# EAGLE design circularpiholder (EAGLE 7.6.0)
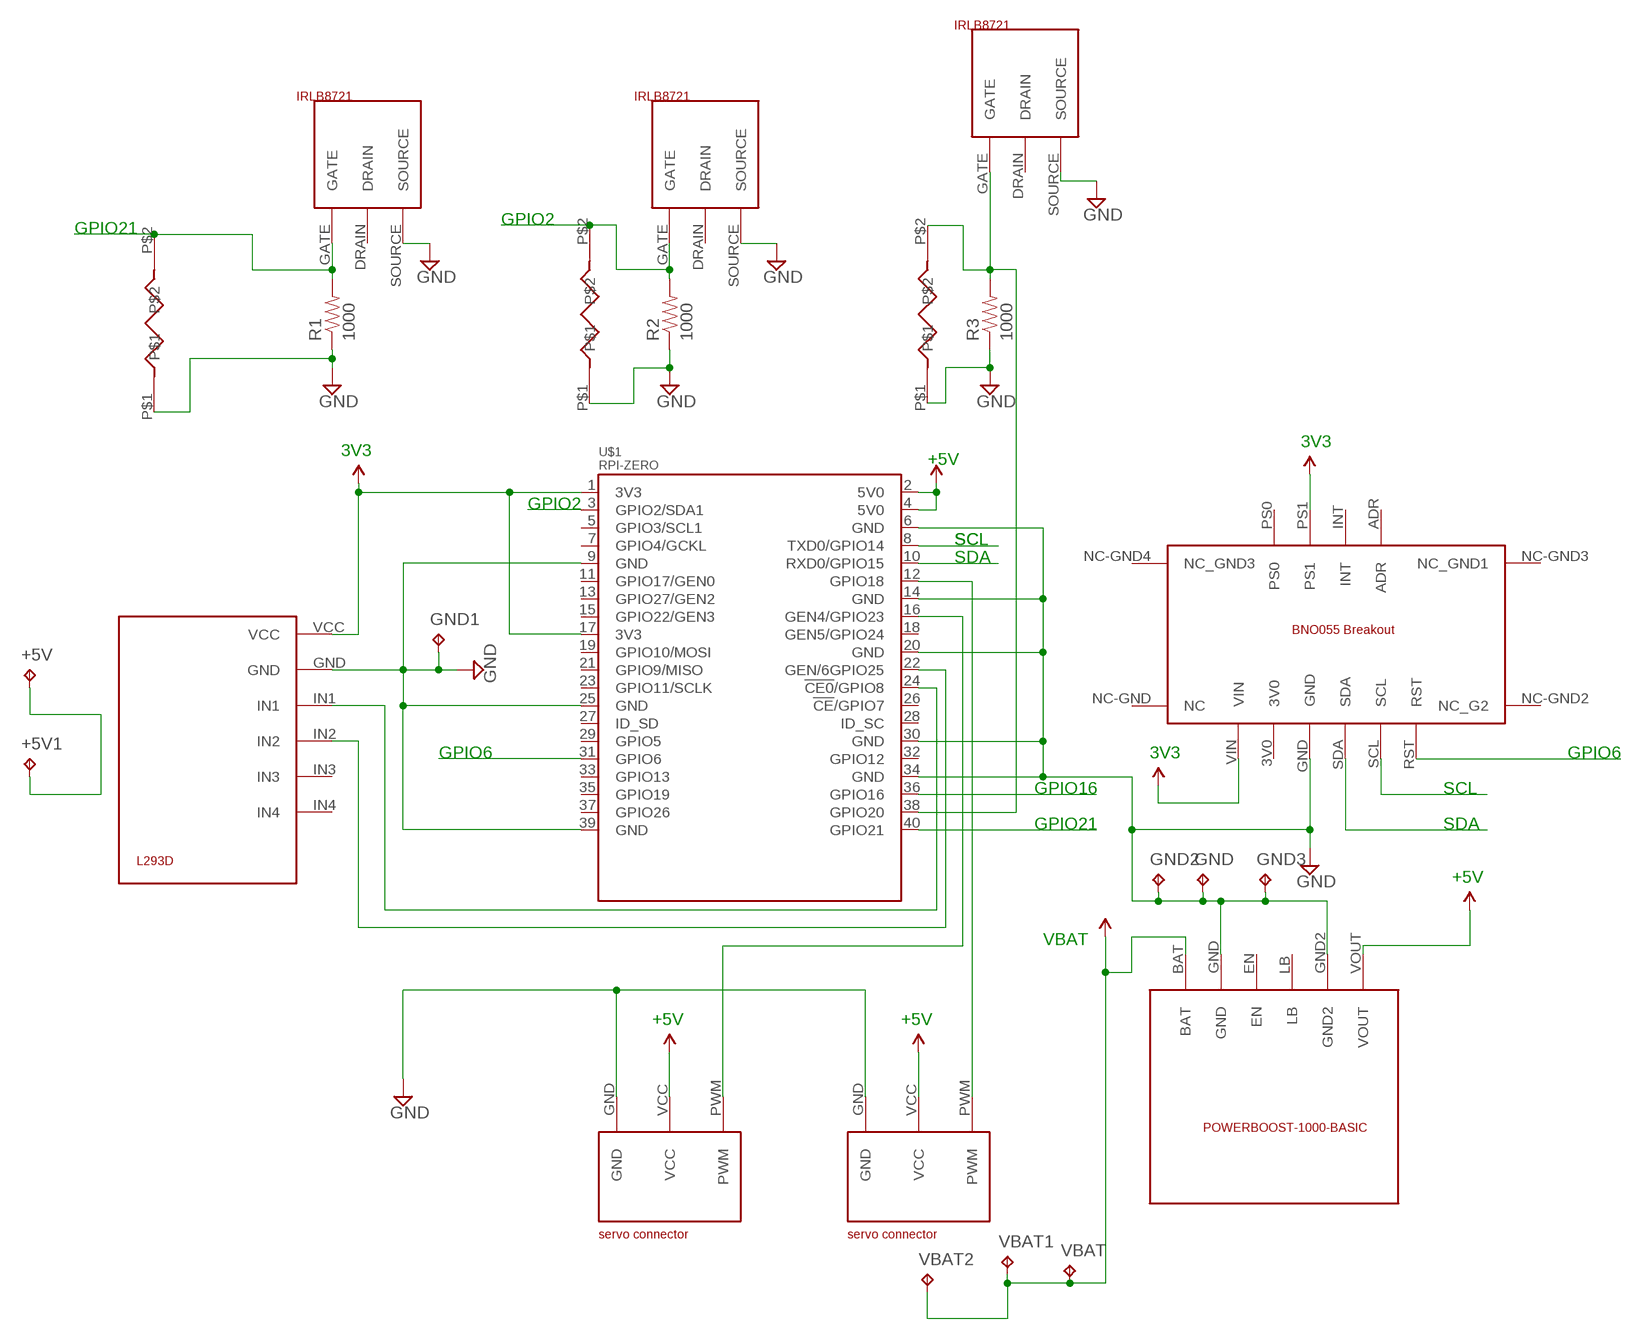
[diagram p0: schematic, sheet 1]

## Parts
+5V  TPTP20SQ  [TP20SQ]
+5V1  TPTP20SQ  [TP20SQ]
GND  TPTP20SQ  [TP20SQ]
GND1  TPTP20SQ  [TP20SQ]
GND2  TPTP20SQ  [TP20SQ]
GND3  TPTP20SQ  [TP20SQ]
R1  1000  RESISTOR0603-RES  [0603-RES]
R2  1000  RESISTOR0603-RES  [0603-RES]
R3  1000  RESISTOR0603-RES  [0603-RES]
U$1  RPI-ZERO  [RASPBERRYPI_BASTELSTUBE_V13_RASPI_BOARD_B+_FULL]
U$2  BNO055-BREAKOUT  [BNO055BREAKOUT]
U$3  POWERBOOST1000-BASIC  [POWERBOOST1000-BASIC]
U$4  MOSFET-IRLB872  [MOSFET-IRLB8721]
U$5  MOSFET-IRLB872  [MOSFET-IRLB8721]
U$6  MOSFET-IRLB872  [MOSFET-IRLB8721]
U$7  L293D-DUALMOTORCONTROL  [L293D-DUALMOTORCONTROL]
U$8  SERVO-3PIN-CONN  [SERVO-3PIN-CONN]
U$9  SERVO-3PIN-CONN  [SERVO-3PIN-CONN]
U$10  SURFACEMNT-RESSURFACEMNT  [SURFACEMNT-RES]
U$11  SURFACEMNT-RESSURFACEMNT  [SURFACEMNT-RES]
U$12  SURFACEMNT-RESSURFACEMNT  [SURFACEMNT-RES]
VBAT  TPTP20SQ  [TP20SQ]
VBAT1  TPTP20SQ  [TP20SQ]
VBAT2  TPTP20SQ  [TP20SQ]

## Nets
3V3: U$1.1(3V3) U$1.17(3V3) U$2.PS1 U$2.VIN U$7.VCC ; supply symbol labelled 5V
+5V: +5V1.TP +5V.TP U$1.2(5V0) U$1.4(5V0) U$3.VOUT U$8.VCC U$9.VCC ; supply symbol labelled 5V
GPIO2: R2.2 U$1.3(GPIO2/SDA1) U$5.GATE U$11.P$2
GPIO6: U$1.31(GPIO6) U$2.RST
GPIO16: U$1.36(GPIO16)
GPIO21: R1.2 U$1.40(GPIO21) U$6.GATE U$10.P$2
GROUND: GND1.TP GND2.TP GND3.TP GND.TP R1.1 R2.1 R3.1 U$1.6(GND) U$1.9(GND) U$1.14(GND) U$1.20(GND) U$1.25(GND) U$1.30(GND) U$1.34(GND) U$1.39(GND) U$2.GND U$3.GND U$3.GND2 U$4.SOURCE U$5.SOURCE U$6.SOURCE U$7.GND U$8.GND U$9.GND U$10.P$1 U$11.P$1 U$12.P$1 ; supply symbol labelled GND
N$1: R3.2 U$1.38(GPIO20) U$4.GATE U$12.P$2
N$3: U$1.12(GPIO18) U$9.PWM
N$4: U$1.16(GEN4/GPIO23) U$8.PWM
N$5: U$1.24(!CE0!/GPIO8) U$7.IN1
N$7: U$1.22(GEN/6GPIO25) U$7.IN2
SCL: U$1.8(TXD0/GPIO14) U$2.SCL
SDA: U$1.10(RXD0/GPIO15) U$2.SDA
VBAT: U$3.BAT VBAT1.TP VBAT2.TP VBAT.TP ; supply symbol labelled 5V
Unconnected: U$1.5(GPIO3/SCL1) U$1.7(GPIO4/GCKL) U$1.11(GPIO17/GEN0) U$1.13(GPIO27/GEN2) U$1.15(GPIO22/GEN3) U$1.18(GEN5/GPIO24) U$1.19(GPIO10/MOSI) U$1.21(GPIO9/MISO) U$1.23(GPIO11/SCLK) U$1.26(!CE!/GPIO7) U$1.27(ID_SD) U$1.28(ID_SC) U$1.29(GPIO5) U$1.32(GPIO12) U$1.33(GPIO13) U$1.35(GPIO19) U$1.37(GPIO26) U$2.3V0 U$2.ADR U$2.INT U$2.NC-GND2(NC_G2) U$2.NC-GND3(NC_GND1) U$2.NC-GND4(NC_GND3) U$2.NC-GND(NC) U$2.PS0 U$3.EN U$3.LB U$4.DRAIN U$5.DRAIN U$6.DRAIN U$7.IN3 U$7.IN4

## Notes on the sheet
- GPIO2
- GPIO21
- 3V3
- 3V3
- +5V
- GPIO2
- SCL | SCL
- SDA
- GPIO6 | 3V3 | GPIO6
- GPIO16 | SCL
- GPIO21 | SDA
- +5V
- VBAT
- +5V | +5V

## Library data of the parts
+5V +5V1 GND GND1-GND3 VBAT VBAT1 VBAT2 = testpad:TP: Test pad
R1-R3 = SparkFun-Passives:RESISTOR: Resistor Basic schematic elements and footprints for 0603, 1206, and PTH resistors.
U$1 = RPI-Zero:RPI-ZERO
U$2 = PetesLibraryTest:BNO055-BREAKOUT
U$3 = PetesLibraryTest:POWERBOOST1000-BASIC
U$4-U$6 = PetesLibraryTest:MOSFET-IRLB872
U$7 = PetesLibraryTest:L293D-DUALMOTORCONTROL
U$8 U$9 = PetesLibraryTest:SERVO-3PIN-CONN
U$10-U$12 = PetesLibraryTest:SURFACEMNT-RES

## Board
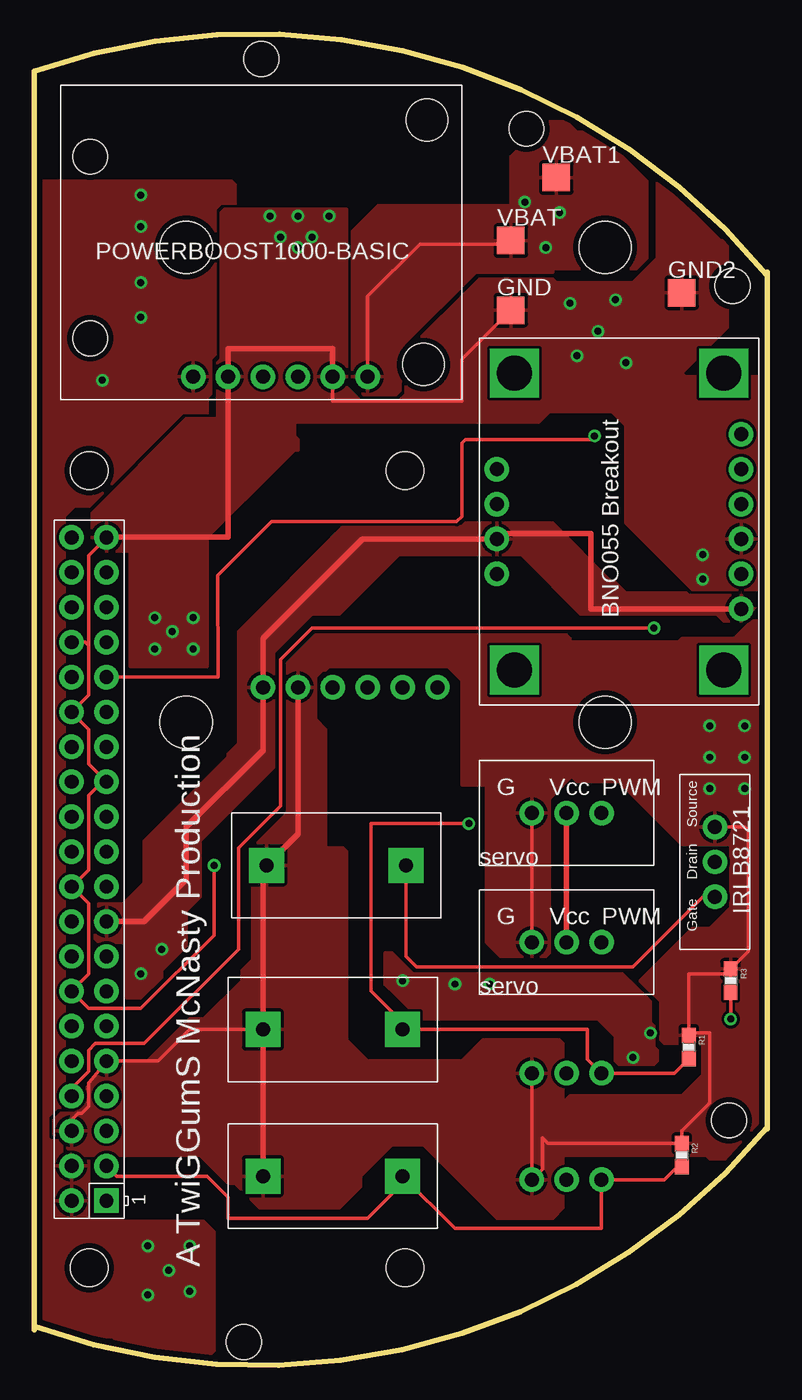
[diagram p1: board, top side]
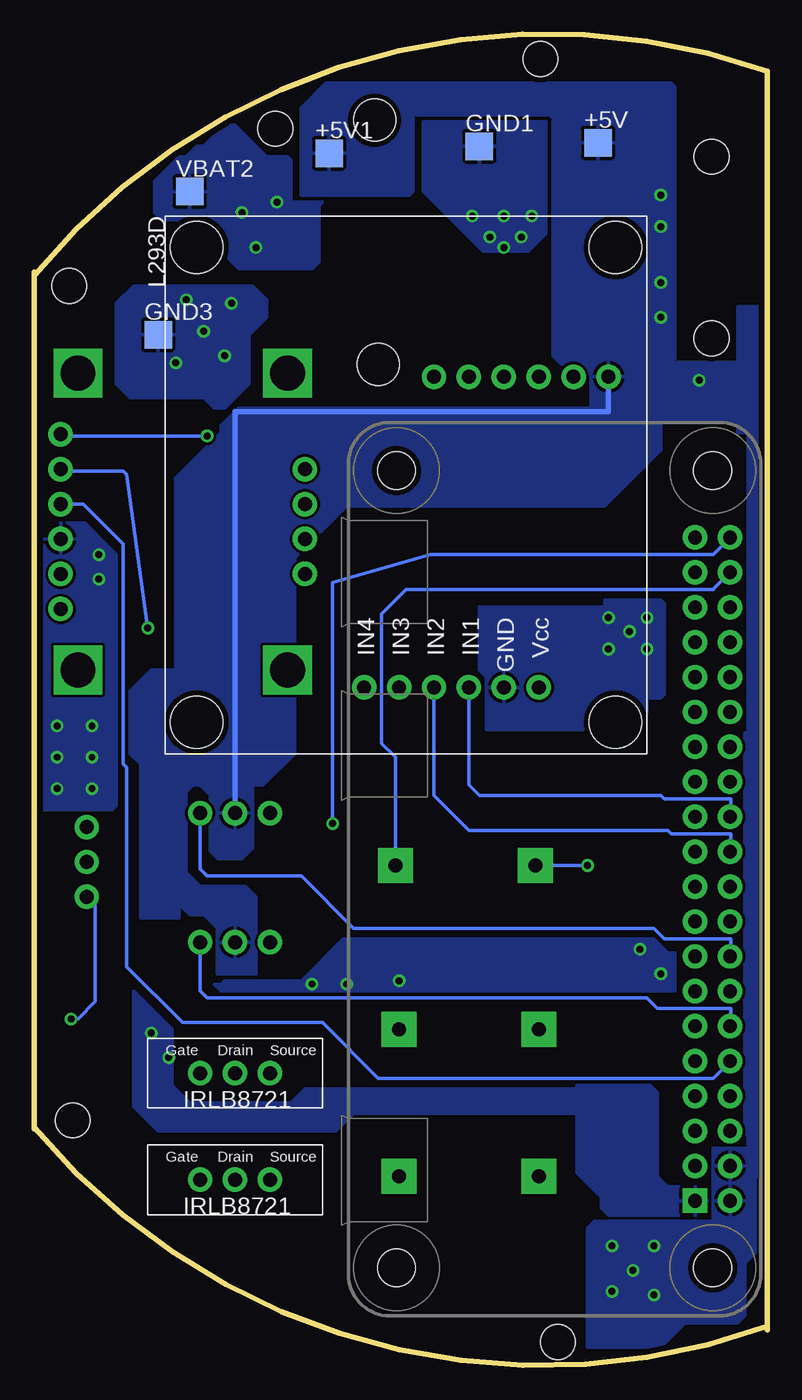
[diagram p2: board, bottom side, seen from below]

Size 53.34 x 96.82 mm. Coordinates in mm from the lower left corner, seen from the top.
Outline: 0,2.57 0,2.83
Outline: 0,2.83 0,94.14 arc-70 53.34,79.28
Outline: 53.34,79.53 53.34,79.28
Outline: 53.34,79.28 53.34,17.3
Outline: 53.34,17.3 53.34,17.18
Outline: 53.34,17.3 arc-70 0,2.83
Copper layers (1*16): Top 0.035mm / dielectric 1.5mm / Bottom 0.035mm
Design rules "forCircularPiHolder": minimum track width 10mil, minimum drill 10mil, track to track 8mil, track to pad 8mil, pad to pad 8mil, via to via 8mil, smd to smd 8mil, copper to edge 16mil, drill to drill 8mil, minimum pad ring 10mil, minimum via ring 8mil, stop-mask expansion 2mil, vias tented up to drill 0mil, thermal gap 10mil
Holes 2.54 mm at 15.24,1.68 16.51,95.03 35.81,89.95 50.55,17.81 50.8,78.52

### Footprints (pad centres in the part's own frame; a part is rotated, then mirrored left to right if it is on the bottom)
TP20SQ = smd 2 x 2: TP 0,0
0603-RES = smd 1.1 x 1: 1 -0.85,0; 2 0.85,0
RASPBERRYPI_BASTELSTUBE_V13_RASPI_BOARD_B+_FULL = drill 1 pad 1.778 square: 1 8.37,25.23 | drill 1 pad 1.778: 2 8.37,27.77; 3 10.91,25.23; 4 10.91,27.77; 5 13.45,25.23; 6 13.45,27.77; 7 15.99,25.23; 8 15.99,27.77; 9 18.53,25.23; 10 18.53,27.77; 11 21.07,25.23; 12 21.07,27.77; 13 23.61,25.23; 14 23.61,27.77; 15 26.15,25.23; 16 26.15,27.77; 17 28.69,25.23; 18 28.69,27.77; 19 31.23,25.23; 20 31.23,27.77; 21 33.77,25.23; 22 33.77,27.77; 23 36.31,25.23; 24 36.31,27.77; 25 38.85,25.23; 26 38.85,27.77; 27 41.39,25.23; 28 41.39,27.77; 29 43.93,25.23; 30 43.93,27.77; 31 46.47,25.23; 32 46.47,27.77; 33 49.01,25.23; 34 49.01,27.77; 35 51.55,25.23; 36 51.55,27.77; 37 54.09,25.23; 38 54.09,27.77; 39 56.63,25.23; 40 56.63,27.77 | hole 2.75: 3.5,3.5; 3.5,26.5; 61.5,3.5; 61.5,26.5
BNO055BREAKOUT = drill 1.016 pad 1.778: 3V0 9.525,1.27; ADR 17.145,19.05; GND 12.065,1.27; INT 14.605,19.05; PS0 9.525,19.05; PS1 12.065,19.05; RST 19.685,1.27; SCL 17.145,1.27; SDA 14.605,1.27; VIN 6.985,1.27 | drill 2.54 square: NC-GND 2.54,17.78; NC-GND2 24.13,17.78; NC-GND3 2.54,2.54; NC-GND4 24.13,2.54
POWERBOOST1000-BASIC = drill 1.016 pad 1.778: BAT 6.858,21.209; EN 11.938,21.209; GND 9.398,21.209; GND2 17.018,21.209; LB 14.478,21.209; VOUT 19.558,21.209 | hole 3.048: 2.54,2.54; 2.794,20.32 | hole 2.54: 27.051,5.207; 27.051,18.415
MOSFET-IRLB8721 = drill 1.016 pad 1.778: DRAIN 2.54,0; GATE 0,0; SOURCE 5.08,0
L293D-DUALMOTORCONTROL = drill 1.016 pad 1.778: GND 34.29,24.638; IN1 34.29,22.098; IN2 34.29,19.558; IN3 34.29,17.018; IN4 34.29,14.478; VCC 34.29,27.178 | hole 3.81: 2.286,2.286; 2.286,32.766; 36.83,32.766; 36.83,2.286
SERVO-3PIN-CONN = drill 1.016 pad 1.778: GND -3.81,0; PWM 1.27,0; VCC -1.27,0
SURFACEMNT-RES = drill 1.016 pad 2.54 square: P$1 -5.08,0; P$2 5.08,0

### Placement (x,y rotation side)
+5V  12.32,88.93 0 bottom
+5V1  31.88,88.17 0 bottom
GND  34.67,76.74 0 top
GND1  20.96,88.68 0 bottom
GND2  47.12,78.01 0 top
GND3  44.32,74.96 0 bottom
R1  47.63,23.15 270 top
R2  47.12,15.27 270 top
R3  50.67,27.97 270 top
U$1  30.48,3.59 90 top
U$2  52.71,48.04 90 top
U$3  31.12,93.12 180 top
U$4  49.53,34.07 90 top
U$5  41.27,13.49 0 bottom
U$6  41.27,21.24 0 bottom
U$7  43.82,83.6 270 bottom
U$8  40.01,40.16 0 top
U$9  40.01,30.77 0 top
U$10  21.72,24.42 0 top
U$11  21.72,13.75 0 top
U$12  21.97,36.35 0 top
VBAT  34.67,81.82 0 top
VBAT1  37.97,86.39 0 top
VBAT2  42.04,85.38 0 bottom

### Tracks (layer width: path | path; a pad name or v marks a point on that pad's centre or on a via)
3V3  (via drill 0.51 pad 0.25)
  Top 0.406: U$2.VIN 40.51,55.02 40.51,60.48 33.66,60.48 U$2.PS1 23.88,60.1 16.64,52.86 U$7.VCC 16.64,44.74 11.05,39.15 11.05,35.34 8,32.29 5.26,32.29 U$1.17
  other vias: 9.27,30.26 7.75,28.48 44.83,24.16 26.8,27.97 33.15,27.72 30.61,27.72 43.56,22.38
  pour Top (rank 5): 6.48,33.56 4.7,33.56 4.7,33.31 4.45,33.05 4.45,31.78 4.45,31.02 4.7,30.77 8.76,30.77 9.27,31.27 12.07,34.07 12.07,37.88 12.07,38.13 17.4,43.47 17.4,51.85 20.19,54.64 22.23,54.64 26.54,58.96 35.43,58.96 35.69,58.71 39.75,54.64 49.66,54.64 50.16,54.13 51.43,54.13 52.45,55.15 52.45,55.91 52.2,56.17 43.05,56.17 42.29,56.93 42.04,56.93 37.72,61.25 31.37,61.25 31.12,60.99 22.48,60.99 14.86,53.37 14.86,45.24 14.1,44.48 14.1,44.23 8,38.13 8,35.08
  pour Top: 11.05,33.81 11.05,30.51 9.27,28.73 9.27,28.23 7.75,26.7 6.73,26.7 6.73,32.29 6.98,32.54 9.78,32.54
  pour Bottom (rank 5): 8,19.84 8,13.75 7.24,12.99 4.19,12.99 4.19,11.21 4.7,10.7 11.3,10.7 12.07,11.46 12.07,12.22 13.84,14 13.84,20.35 8.51,20.35
  pour Bottom (rank 5): 12.83,20.1 33.66,20.1 34.67,19.08 42.04,19.08 43.31,20.35 43.31,24.42 46.1,27.21 46.1,18.83 44.32,17.05 31.37,17.05 30.1,18.32 13.84,18.32 12.83,19.34
  pour Bottom: 10.8,31.02 8.26,31.02 7.24,30 6.73,30 6.73,27.21 39.75,27.21 40.26,27.72 39.75,27.72 39.5,27.97 33.91,27.97 30.86,31.02
  pour Top: 44.83,25.69 44.83,24.92 45.09,24.67 45.09,23.15 45.34,22.89 45.34,22.13 45.09,21.88 42.55,21.88 42.29,22.13 42.29,23.91 41.02,25.18 28.07,25.18 26.29,26.96 25.53,27.72 25.53,30 26.04,30 26.54,29.5 27.56,28.48 42.8,28.48 43.82,27.46 44.83,26.45
+5V  (via drill 0.51 pad 0.25)
  Top 0.406: U$8.VCC U$9.VCC
  Bottom 0.406: U$3.VOUT 11.56,69.37 38.74,69.37 U$8.VCC
  other vias: 7.75,85.12 7.75,82.84 7.75,78.77 7.75,76.23 4.95,71.66 8.26,8.67 11.3,8.67 11.3,5.37 8.26,5.11 9.78,6.89
  pour Bottom: 11.56,73.18 12.83,73.18 12.83,69.37 9.78,69.37 9.78,73.18
  pour Bottom: 0.89,15.53 0.89,8.92 3.94,8.92 3.94,15.78 0.89,15.78
  pour Bottom: 10.29,72.93 1.14,72.93 1.14,72.42 1.4,72.42 1.4,68.61 10.29,68.61
  pour Bottom: 0.64,15.53 0.64,13.75 1.4,13.75 1.4,14 1.4,15.53
  pour Bottom: 1.4,17.81 1.4,14 0.13,14 0.13,17.81
  pour Bottom: 1.65,18.57 1.65,16.8 0.38,16.8 0.38,76.99 2.16,76.99 2.16,67.85 1.4,67.85 1.4,46.01 1.65,46.01
  pour Bottom: 15.62,90.46 15.62,73.44 14.35,72.17 7.75,72.17 6.73,73.18 6.73,89.69 7.49,90.46
  pour Bottom: 7.75,66.58 7.75,69.12 8.26,69.63 38.48,69.63 39.75,68.36 39.75,67.85 43.05,64.55 43.05,33.81 42.04,32.8 41.02,32.8 40.01,31.78 40.01,28.48 37.21,28.48 37.21,34.07 37.97,34.83 41.27,34.83 42.29,35.85 42.29,41.69 41.78,42.2 36.7,42.2 34.42,44.48 34.42,58.71 30.61,62.52 11.81,62.52
  pour Bottom: 40.01,36.86 38.23,36.86 37.46,37.62 37.46,43.97 37.46,49.05 38.99,50.58 44.83,50.58 46.35,49.05 46.35,44.48 45.59,43.72 45.59,32.54 42.8,32.54 42.8,34.58 42.55,34.83 42.55,43.21 42.29,43.21 40.51,41.43 40.51,37.37
  pour Top (rank 4): 3.94,15.78 3.94,10.7 3.68,10.45 12.32,10.45 13.08,9.68 13.08,1.05 12.83,0.79 9.78,0.79 9.27,1.3 6.48,1.3 5.72,2.06 3.68,2.06 3.18,2.57 1.91,2.57 1.4,3.08 0.64,3.08 0.38,3.33 0.38,85.88 0.64,86.14 14.35,86.14 14.61,85.88 14.61,75.98 14.1,75.47 14.1,74.45 12.83,73.18 12.83,70.64 12.57,70.39 12.57,68.61 6.48,62.52 2.92,62.52 2.16,61.75 2.16,18.83 1.65,18.32 1.65,16.29 2.16,15.78
  pour Bottom: 2.92,10.45 12.57,10.45 13.08,9.94 13.08,1.3 7.75,1.3 5.97,3.08 2.16,3.08 1.65,3.59 1.65,7.4 0.89,8.16 0.89,10.45
  pour Bottom: 33.91,91.47 33.91,85.12 26.04,85.12 25.78,85.38 25.78,90.96 15.88,90.96 14.86,89.95 6.98,89.95 6.73,89.69 6.73,93 6.98,93.25 32.13,93.25
GPIO2
  Top 0.254: U$1.3 6,13.75 12.57,13.75 14.1,12.22 14.1,10.7 24.26,10.7 26.8,13.24 U$11.P$2 30.61,9.94 41.27,9.94 U$5.GATE 45.85,13.49 46.61,14.26 46.95,14.26 R2.2
GPIO6  (via drill 0.51 pad 0.25)
  Top 0.254: U$1.31 13.39,50.07 13.34,57.44 17.27,61.37 30.73,61.37 31.12,61.75 31.12,67.09 31.37,67.34 40.51,67.34 v40.77,67.6
  Bottom 0.254: U$2.RST 51.31,67.6 v40.77,67.6
GPIO21  (via drill 0.51 pad 0.25)
  Top 0.254: v31.62,39.4 24.51,39.4 24.51,27.21 26.8,24.92 U$10.P$2 40.26,24.42 40.26,22.26 U$6.GATE 46.57,21.24 R1.2
  Bottom 0.254: U$1.40 3.94,58.99 3.94,58.96 24.51,58.96 31.62,56.93 v31.62,39.4
GROUND  (via drill 0.51 pad 0.25)
  Top 0.254: U$10.P$1 11.3,24.42 9.02,22.13 5.26,22.13 U$1.9 3.94,20.55 3.94,18.83 3.43,18.32 3.18,18.32 2.71,17.85 U$1.6 | U$4.SOURCE 51.69,39.15 51.94,38.89 51.94,30.09 R3.1 50.33,28.48 47.63,28.48 R1.1 47.79,24.16 49.15,24.16 49.15,19.08 47.12,17.05 R2.1 37.38,16.12 36.96,16.54 36.96,14.26 U$5.SOURCE U$6.SOURCE | U$1.39 3.94,58.9 3.94,52.36 | 3.94,52.36 3.7,52.6 U$1.34 | 3.94,52.36 3.94,48.74 U$1.30 2.71,47.49 3.94,46.26 3.94,43.75 U$1.25 4.94,42.44 3.94,41.43 3.94,36.04 U$1.20 3.94,33.59 3.94,28.48 2.71,27.25 U$1.14 3.97,25.94 7.75,25.94 13.08,31.27 v13.08,36.35 | GND.TP 31.12,73.18 31.12,70.14 21.72,70.14 U$3.GND | U$8.GND U$9.GND
  Top 0.406: U$1.39 5.25,60.23 14.1,60.23 U$3.GND2 14.1,73.95 21.72,73.95 U$3.GND | U$7.GND 19.18,38.64 U$12.P$1 16.64,36.1 U$10.P$1 U$11.P$1
  Bottom 0.254: v13.08,36.35 U$12.P$1
  other vias: 21.46,83.6 20.19,82.07 19.18,81.31 17.91,82.07 19.18,83.6 17.15,83.6 51.69,46.51 49.15,46.51 49.15,44.23 51.69,44.23 48.64,58.96 49.15,41.94 51.69,41.94 48.64,57.18 8.76,54.39 11.56,54.39 11.56,52.1 8.76,52.1 10.03,53.37 38.99,77.25 42.29,77.5 39.5,73.44 43.05,72.93 41.02,75.22
  pour Top: 37.72,79.03 32.38,79.03 27.05,73.69 27.05,70.64 26.54,70.14 23.75,70.14 22.73,71.15 22.73,84.11 13.84,84.11 13.59,83.85 13.59,73.18 13.34,72.93 13.34,67.34 15.11,67.34 15.88,68.1 17.4,68.61 36.7,68.61 37.97,69.88 37.97,78.77
  pour Top: 19.18,66.58 18.92,66.58 11.56,59.21 4.7,59.21 4.19,59.72 4.19,61.25 4.19,62.01 11.05,68.87 18.67,68.87 18.92,69.12 18.92,67.6 19.18,67.34
  pour Top: 52.96,61.25 52.96,56.67 52.71,56.42 47.88,56.42 43.05,61.25 43.05,68.36 42.04,69.37 37.21,69.37 36.96,69.12 36.96,75.22 37.46,75.72 43.56,75.72 47.37,71.91 52.96,71.91
  pour Bottom: 16.13,90.46 16.13,82.33 17.4,81.06 20.7,81.06 25.02,85.38 25.02,90.46
  pour Top: 38.99,52.86 38.99,42.7 37.46,41.18 37.46,30 37.21,29.75 33.91,29.75 32.89,30.77 32.89,52.86 33.15,53.12 38.74,53.12
  pour Top (rank 3): 38.48,23.4 38.48,11.46 37.72,10.7 33.66,10.7 28.32,16.03 26.04,16.03 23.75,13.75 23.75,12.99 22.23,11.46 16.38,11.46 14.61,13.24 14.1,13.24 12.07,15.27 2.92,15.27 1.4,16.8 1.4,17.81 1.91,18.32 2.92,18.32 3.68,19.08 3.68,20.1 5.72,22.13 8.26,22.13 11.3,25.18 12.32,25.18 15.11,27.97 15.11,28.73 15.88,29.5 15.88,37.62 22.48,37.62 22.73,37.37 22.73,23.65 24.26,22.13 31.12,22.13 32.64,23.65 38.23,23.65
  pour Top: 52.71,37.88 47.12,37.88 42.55,42.45 39.5,42.45 37.46,44.48 37.46,51.34 38.74,52.61 46.86,52.61 47.12,52.86 50.93,52.86 52.2,54.13 52.96,54.13 52.96,38.64 52.96,38.13
  pour Top: 48.9,15.27 37.97,15.27 37.72,15.53 37.72,18.32 38.99,19.59 47.12,19.59 48.64,21.11 48.64,23.4 45.85,23.4 45.59,23.65 45.59,26.45 44.07,27.97 47.88,31.78 49.15,31.78 50.67,33.31 50.67,38.39 50.42,38.64 53.21,38.64 53.21,18.07 53.47,17.81 53.47,17.56 50.93,15.02 49.15,15.02
  pour Bottom: 52.71,61.25 49.91,61.25 49.66,61.25 47.88,59.47 47.37,58.96 47.37,49.05 47.37,40.67 47.63,40.42 52.71,40.42 53.21,40.93 53.21,60.48 53.21,60.74
  pour Top: 19.94,50.32 19.18,50.32 18.41,49.56 18.41,40.16 16.13,37.88 16.13,34.58 16.38,34.32 18.41,34.32 21.21,37.12 21.21,46.26 20.45,47.02 20.45,49.82
  pour Bottom: 14.1,55.15 20.96,55.15 20.96,50.58 20.45,50.07 20.45,46.26 8.76,46.26 8.76,54.64 9.27,55.15
  pour Bottom: 11.81,55.66 11.81,53.12 11.56,52.86 11.56,51.59 8.51,48.55 7.75,48.55 7.49,48.8 7.49,55.4 7.75,55.66
  pour Top: 12.57,61.25 12.57,50.83 6.98,50.83 6.98,59.98 7.49,60.48 11.81,60.48
  pour Top: 34.16,53.12 20.45,53.12 19.18,51.85 18.41,51.09 18.41,48.04 18.67,47.78 19.94,47.78 20.45,48.29 20.45,50.07 20.96,50.58 21.21,50.58 21.46,50.83 30.1,50.83 30.61,50.32 31.12,49.82 31.12,42.2 34.42,42.2 34.67,41.94 34.67,44.99 37.21,47.53 37.21,48.55 38.48,49.82 38.48,52.86 38.23,53.12
  pour Top: 45.34,84.61 45.34,80.55 43.56,78.77 37.46,78.77 37.21,79.03 37.21,75.22 38.74,73.69 44.58,73.69 46.61,71.66 50.42,75.47 50.42,81.82 49.91,81.82 45.85,85.88 45.34,86.39
  pour Bottom: 38.74,78.52 46.1,78.52 47.37,77.25 47.37,71.41 46.35,70.39 41.02,70.39 40.26,69.63 39.5,69.63 37.72,71.41 37.72,74.96 36.45,76.23 36.45,77.5 37.46,78.52
N$1  (via drill 0.51 pad 0.25)
  Top 0.254: v50.67,25.18 R3.2 | U$12.P$2 27.05,29.75 27.81,28.99 43.56,28.99 48.64,34.07 U$4.GATE
  Bottom 0.254: U$1.38 3.94,56.45 3.94,56.42 26.29,56.42 28.07,54.64 28.07,45.24 27.05,44.23 U$12.P$2 | U$4.GATE 48.9,33.43 48.9,26.45 50.16,25.18 v50.67,25.18
N$3
  Bottom 0.254: U$9.PWM 41.27,27.21 40.77,26.7 8.76,26.7 8,25.94 2.67,25.94 2.67,24.7 U$1.12
N$4
  Bottom 0.254: U$8.PWM 41.27,36.1 40.77,35.59 33.91,35.59 30.1,31.78 8.26,31.78 7.49,31.02 2.67,31.02 2.67,29.78 U$1.16
N$5
  Bottom 0.254: U$7.IN1 21.72,42.2 20.96,41.43 7.75,41.43 7.49,41.18 2.67,41.18 2.67,39.94 U$1.24
N$7
  Bottom 0.254: U$7.IN2 24.26,41.43 21.72,38.89 7.24,38.89 6.98,38.64 2.67,38.64 2.67,37.4 U$1.22
SCL  (via drill 0.51 pad 0.25)
  Top 0.254: U$1.8 2.71,20.14 3.94,21.37 3.94,22.89 4.45,23.4 8,23.4 14.86,30.26 14.86,37.62 17.91,40.67 17.91,51.34 20.19,53.63 v45.09,53.63
  Bottom 0.254: v45.09,53.63 46.61,64.8 46.86,65.06 51.31,65.06 U$2.SCL
SDA
  Bottom 0.254: U$2.SDA 49.78,62.64 46.86,59.72 46.86,43.72 46.61,43.47 46.61,28.99 42.55,24.92 32.38,24.92 28.32,20.86 3.94,20.86 2.71,22.09 U$1.10
VBAT  (via drill 0.51 pad 0.25)
  Top 0.254: VBAT.TP 34.42,81.57 28.07,81.57 24.26,77.76 U$3.BAT
  other vias: 38.23,83.85 35.69,84.61 37.21,81.31
  pour Top (rank 2): 37.72,84.61 37.72,79.53 32.13,79.53 26.8,74.2 28.58,71.66 26.54,69.63 21.21,70.64 20.96,70.9 20.96,80.3 25.02,84.36 36.2,84.36 36.45,84.61
  pour Top: 34.67,84.11 34.67,87.92 37.21,90.46 38.74,90.46 39.5,89.69 41.02,89.69 44.58,86.14 44.58,80.55 43.82,79.79 36.96,79.79 36.45,80.3 36.45,82.33
  pour Bottom: 42.29,87.92 42.8,87.92 44.58,86.14 44.58,83.85 44.07,83.34 42.04,83.34 38.48,79.79 33.15,79.79 32.64,80.3 32.64,84.36 32.38,84.61 34.67,84.61 34.67,87.66 34.93,87.92 36.45,87.92 38.74,90.2 39.5,90.2 41.02,88.68 41.53,88.68

### Text on the board
tNames: A TwiGGumS McNasty Production